# EAGLE design Lora_Basic_Gateway_ Module_V1.0_20230419 (EAGLE 9.5.1)
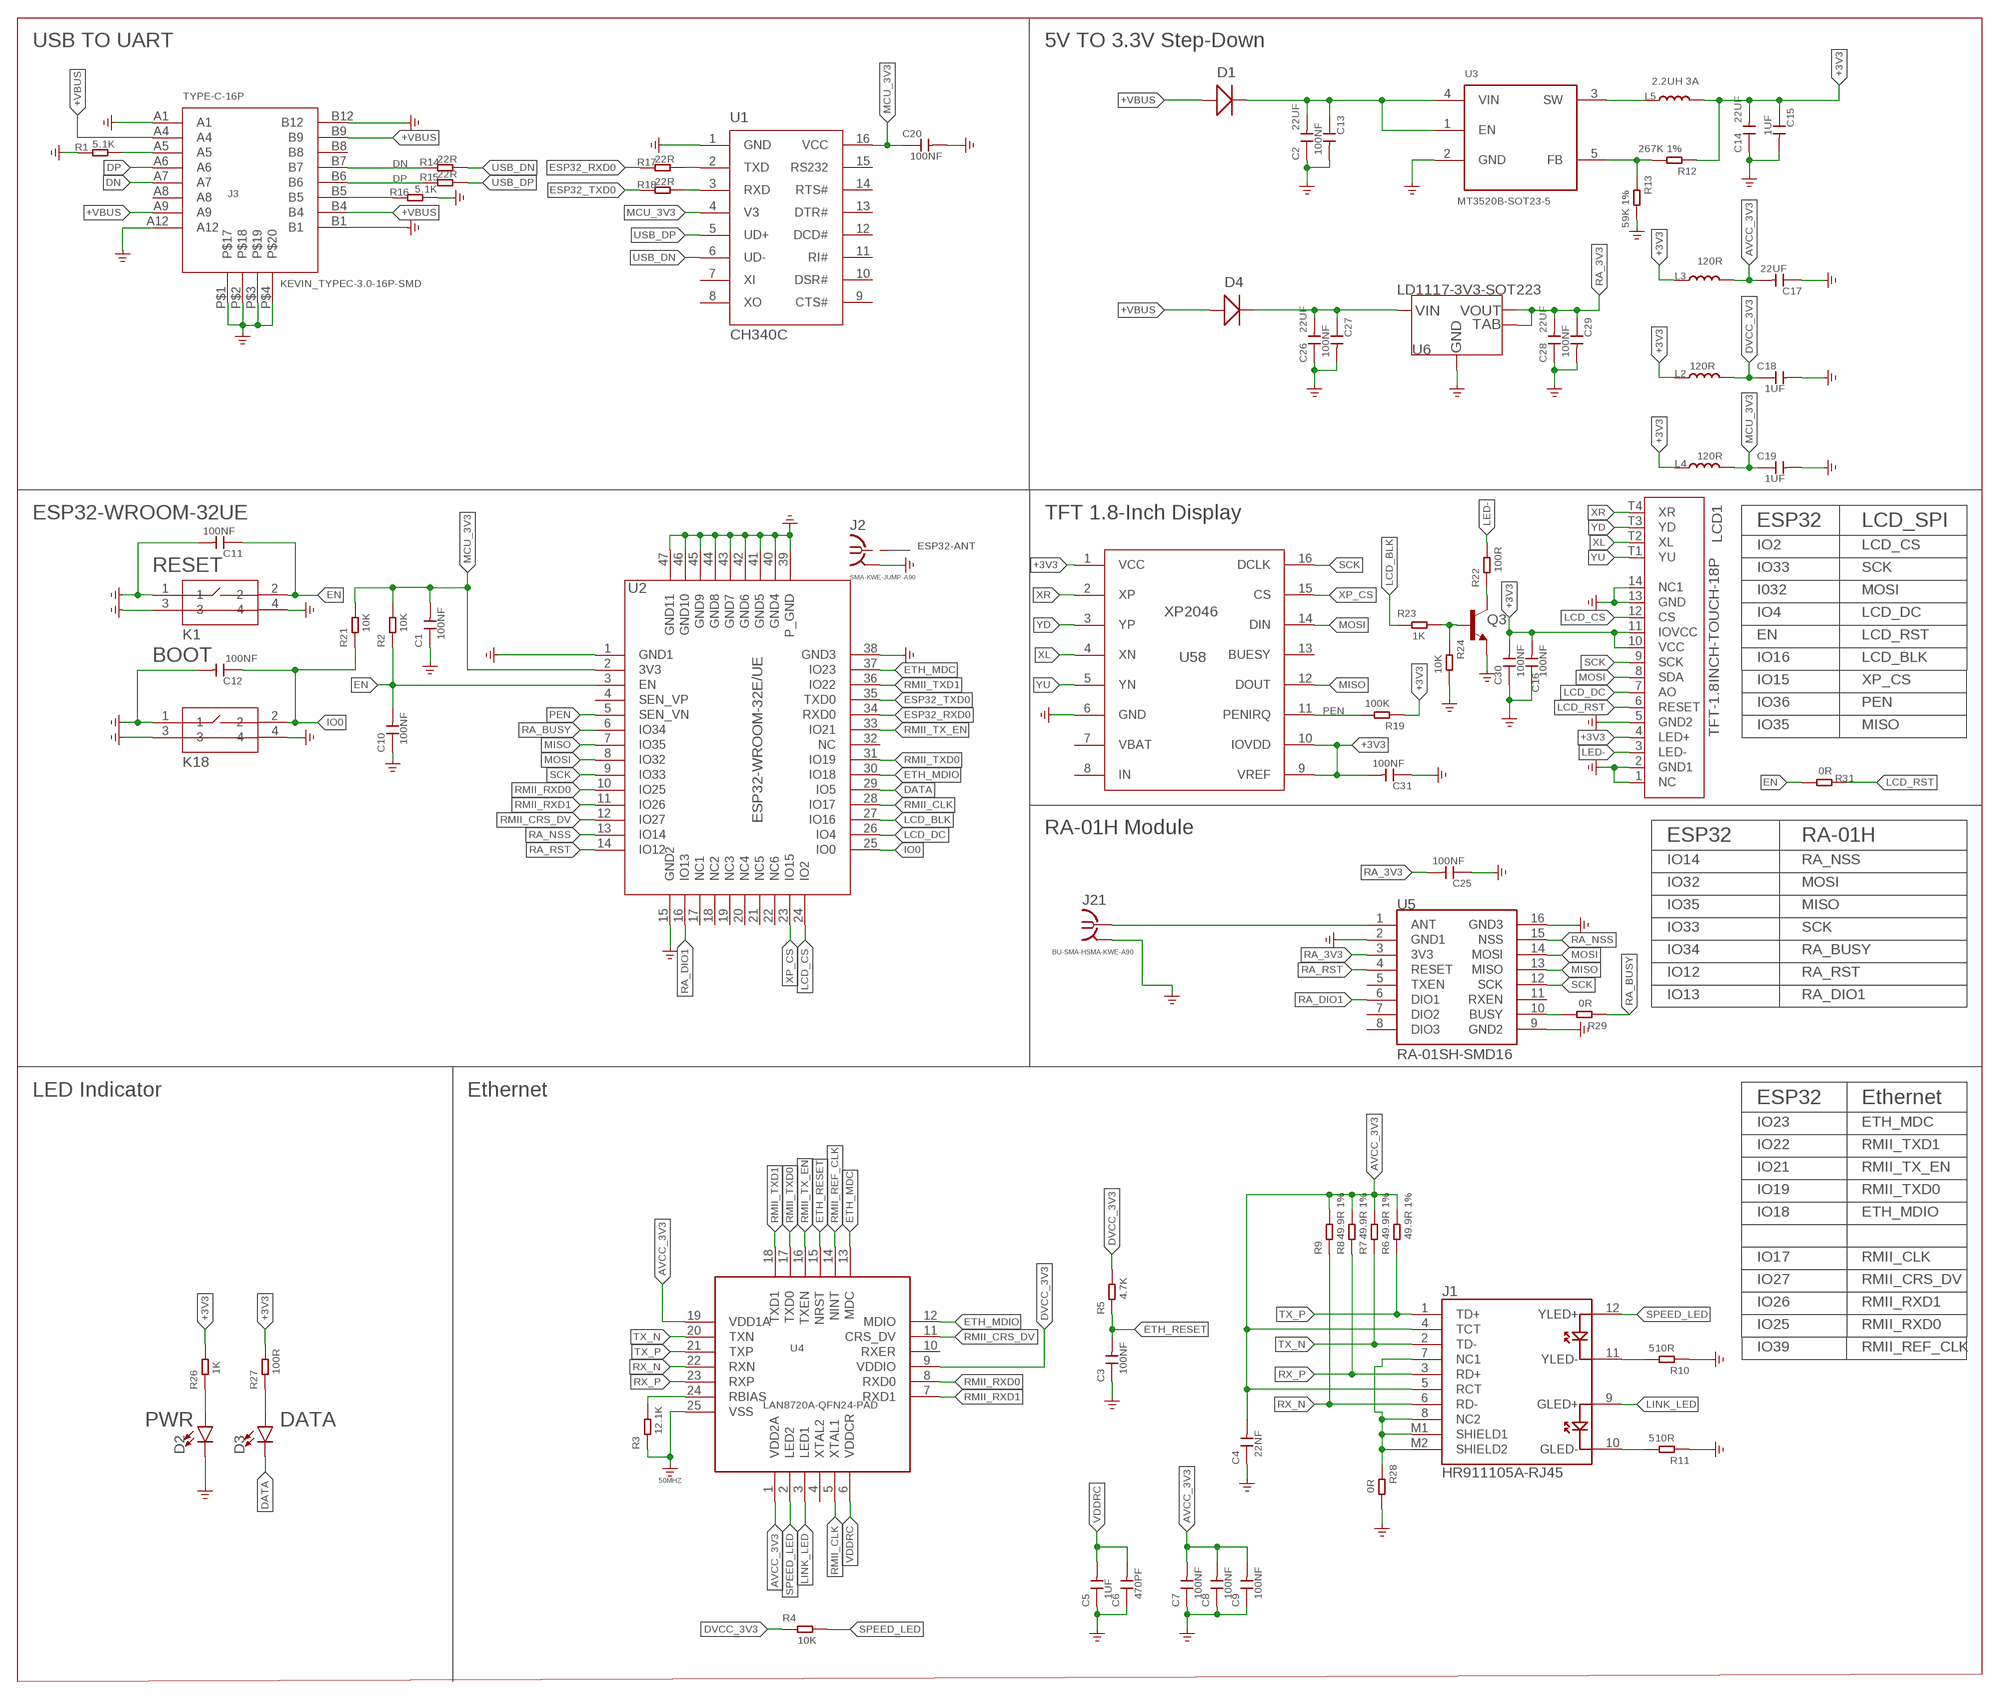
[diagram p0: schematic, sheet 1]

## Parts
C1  100NF  C0603  [C0603]
C2  22UF  C0805  [C0805]
C3  100NF  C0603  [C0603]
C4  22NF  C0603  [C0603]
C5  1UF  C0603  [C0603]
C6  470PF  C0603  [C0603]
C7  100NF  C0603  [C0603]
C8  100NF  C0603  [C0603]
C9  100NF  C0603  [C0603]
C10  100NF  C0603  [C0603]
C11  100NF  C0603  [C0603]
C12  100NF  C0603  [C0603]
C13  100NF  C0603  [C0603]
C14  22UF  C0805  [C0805]
C15  1UF  C0603  [C0603]
C16  100NF  C0603  [C0603]
C17  22UF  C0805  [C0805]
C18  1UF  C0603  [C0603]
C19  1UF  C0603  [C0603]
C20  100NF  C0603  [C0603]
C25  100NF  C0603  [C0603]
C26  22UF  C0805  [C0805]
C27  100NF  C0603  [C0603]
C28  22UF  C0805  [C0805]
C29  100NF  C0603  [C0603]
C30  100NF  C0603  [C0603]
C31  100NF  C0603  [C0603]
D1  DIODEB130L-13-F  [SMA]
D2  LED  [LED-F3MM-DIP2-A90]
D3  LED  [LED-F3MM-DIP2-A90]
D4  DIODEB130L-13-F  [SMA]
J1  HR911105A-RJ45  [HR911105A-RJ45]
J2  SMA-KWE-JUMP-A90  [SMA-KWE-JUMP-A90]
J3  KEVIN_TYPEC-3.0-16P-SMD  [KEVIN_3.0TYPEC-SMD]
J21  BU-SMA-HSMA-KWE-A90  [SMA-KWE-A90]
K1  KEY_666MM_DIPA90  [KEY_6*6*6MM_DIPA90]
K18  KEY_666MM_DIPA90  [KEY_6*6*6MM_DIPA90]
L2  120R  L0805  [L0805]
L3  120R  L0603  [L0603]
L4  120R  L0805  [L0805]
L5  2.2UH 3A  L  [L0420]
LCD1  TFT-1.8INCH-TOUCH-18P  [TFT-1.8INCH-TOUCH-18P-SMD]
Q3  600mA/40V  TRANS_NPN-MMBT2222AL  [SOT23-3]
R1  5.1K  R0603  [R0603]
R2  10K  R0603  [R0603]
R3  12.1K  R0603  [R0603]
R4  10K  R0603  [R0603]
R5  4.7K  R0603  [R0603]
R6  49.9R 1%  R0603  [R0603]
R7  49.9R 1%  R0603  [R0603]
R8  49.9R 1%  R0603  [R0603]
R9  49.9R 1%  R0603  [R0603]
R10  510R  R0603  [R0603]
R11  510R  R0603  [R0603]
R12  267K 1%  R0603  [R0603]
R13  59K 1%  R0603  [R0603]
R14  22R  R0603  [R0603]
R15  22R  R0603  [R0603]
R16  5.1K  R0603  [R0603]
R17  22R  R0603  [R0603]
R18  22R  R0603  [R0603]
R19  100K  R0603  [R0603]
R21  10K  R0603  [R0603]
R22  100R  R0603  [R0603]
R23  1K  R0603  [R0603]
R24  10K  R0603  [R0603]
R26  1K  R0603  [R0603]
R27  100R  R0603  [R0603]
R28  0R  R0603  [R0603]
R29  0R  R0603  [R0603]
R31  0R  R0603  [R0603]
U1  CH340C  CH340G  [SOP-16]
U2  ESP32-WROOM-32E/UE  [ESP32-WROOM-32UE]
U3  MT3520B-SOT23-5  HM3420B  [IC_SOT23-5]
U4  LAN8720A-QFN24-PAD  [QFN24-PAD]
U5  RA-01SH-SMD16  [RA-01SH-SMD16]
U6  LD1117-3V3-SOT223  [SOT223]
U58  XP2046  [XP2046-SSOP16]

## Nets
+3V3 [PWR]: C14.2 C15.1 C16.2 C30.2 C31.2 L2.1 L3.1 L4.1 L5.2 LCD1.4(LED+) LCD1.10(VCC) LCD1.11(IOVCC) R12.1 R19.1 R26.2 R27.2 U58.1(VCC) U58.9(VREF) U58.10(IOVDD)
+VBUS [PWR]: D1.2(+) D4.2(+) J3.A4 J3.A9 J3.B4 J3.B9
AVCC_3V3 [PWR]: C4.2 C7.2 C8.2 C9.2 C17.2 J1.4(TCT) J1.5(RCT) L3.2 R6.2 R7.2 R8.2 R9.2 U4.1(VDD2A) U4.19(VDD1A)
DATA: D3.K(C) U2.29(IO5)
DN: J3.A7 J3.B7 R14.1
DP: J3.A6 J3.B6 R15.1
DVCC_3V3 [PWR]: C18.1 L2.2 R4.1 R5.2 U4.9(VDDIO)
EN [PWR]: C10.2 C11.1 K1.2 R2.1 R31.2 U2.3(EN)
ESP32_RXD0: R17.1 U2.34(RXD0)
ESP32_TXD0: R18.1 U2.35(TXD0)
ETH_MDC: U2.37(IO23) U4.13(MDC)
ETH_MDIO: U2.30(IO18) U4.12(MDIO)
ETH_RESET: C3.2 R5.1 U4.15(NRST)
GND [PWR]: C1.1 C2.1 C3.1 C4.1 C5.1 C6.1 C7.1 C8.1 C9.1 C10.1 C11.2 C12.2 C13.2 C14.1 C15.2 C16.1 C17.1 C18.2 C19.2 C20.2 C25.1 C26.1 C27.2 C28.1 C29.2 C30.1 C31.1 D2.K(C) J2.2 J2.3 J2.4 J2.5 J3.A1 J3.A12 J3.B1 J3.B12 J3.P$1 J3.P$2 J3.P$3 J3.P$4 J21.2 J21.3 J21.4 J21.5 K1.1 K1.3 K1.4 K18.1 K18.3 K18.4 LCD1.1(NC) LCD1.2(GND1) LCD1.5(GND2) LCD1.13(GND) LCD1.14(NC1) Q3.2(E) R1.1 R3.1 R10.1 R11.1 R13.2 R16.2 R24.2 R28.2 U1.1(GND) U2.1(GND1) U2.15(GND2) U2.38(GND3) U2.39(P_GND) U2.40(GND4) U2.41(GND5) U2.42(GND6) U2.43(GND7) U2.44(GND8) U2.45(GND9) U2.46(GND10) U2.47(GND11) U3.2(GND) U4.25(VSS) U5.2(GND1) U5.9(GND2) U5.16(GND3) U6.1(GND) U58.6(GND) ; supply symbol labelled 50MHZ
IO0: C12.1 K18.2 R21.1 U2.25(IO0)
LCD_BLK: R23.1 U2.27(IO16)
LCD_CS: LCD1.12(CS) U2.24(IO2)
LCD_DC: LCD1.7(AO) U2.26(IO4)
LCD_RST: LCD1.6(RESET) R31.1
LED-: LCD1.3(LED-) R22.2
LINK_LED: J1.9(GLED+) U4.3(LED1)
MCU_3V3: C1.2 C19.1 C20.1 L4.2 R2.2 R21.2 U1.4(V3) U1.16(VCC) U2.2(3V3)
MISO: U2.7(IO35) U5.13(MISO) U58.12(DOUT)
MOSI: LCD1.8(SDA) U2.8(IO32) U5.14(MOSI) U58.14(DIN)
N$1: Q3.3(C) R22.1
N$2: D2.A R26.1
N$3: D3.A R27.1
N$4: C26.2 C27.1 D4.1(-) U6.3(VIN)
N$5: R29.2 U5.10(BUSY)
N$6: J1.7(NC1) J1.8(NC2) J1.M1(SHIELD1) J1.M2(SHIELD2) R28.1
N$9: Q3.1(B) R23.2 R24.1
N$10: J1.10(GLED-) R11.2
N$11 [ANT]: J21.1 U5.1(ANT)
N$15: J1.11(YLED-) R10.2
N$16: C2.2 C13.1 D1.1(-) U3.1(EN) U3.4(VIN)
N$17: R12.2 R13.1 U3.5(FB)
N$18: R3.2 U4.24(RBIAS)
N$19: L5.1 U3.3(SW)
N$20: J3.B5 R16.1
N$21: J3.A5 R1.2
N$22: R17.2 U1.2(TXD)
N$23: R18.2 U1.3(RXD)
PEN: R19.2 U2.5(SEN_VN) U58.11(PENIRQ)
RA_3V3 [PWR]: C25.2 C28.2 C29.1 U5.3(3V3) U6.2(VOUT) U6.4(TAB)
RA_BUSY: R29.1 U2.6(IO34)
RA_DIO1: U2.16(IO13) U5.6(DIO1)
RA_NSS: U2.13(IO14) U5.15(NSS)
RA_RST: U2.14(IO12) U5.4(RESET)
RMII_CLK: U2.28(IO17) U4.5(XTAL1)
RMII_CRS_DV: U2.12(IO27) U4.11(CRS_DV)
RMII_REF_CLK: U4.14(NINT)
RMII_RXD0: U2.10(IO25) U4.8(RXD0)
RMII_RXD1: U2.11(IO26) U4.7(RXD1)
RMII_TX_EN: U2.33(IO21) U4.16(TXEN)
RMII_TXD0: U2.31(IO19) U4.17(TXD0)
RMII_TXD1: U2.36(IO22) U4.18(TXD1)
RX_N: J1.6(RD-) R9.1 U4.22(RXN)
RX_P: J1.3(RD+) R8.1 U4.23(RXP)
SCK: LCD1.9(SCK) U2.9(IO33) U5.12(SCK) U58.16(DCLK)
SPEED_LED: J1.12(YLED+) R4.2 U4.2(LED2)
TX_N: J1.2(TD-) R7.1 U4.20(TXN)
TX_P: J1.1(TD+) R6.1 U4.21(TXP)
USB_DN: R14.2 U1.6(UD-)
USB_DP: R15.2 U1.5(UD+)
VDDRC: C5.2 C6.2 U4.6(VDDCR)
XL: LCD1.T2(XL) U58.4(XN)
XP_CS: U2.23(IO15) U58.15(CS)
XR: LCD1.T4(XR) U58.2(XP)
YD: LCD1.T3(YD) U58.3(YP)
YU: LCD1.T1(YU) U58.5(YN)
Unconnected: J3.A8 J3.B8 U1.7(XI) U1.8(XO) U1.9(CTS#) U1.10(DSR#) U1.11(RI#) U1.12(DCD#) U1.13(DTR#) U1.14(RTS#) U1.15(RS232) U2.4(SEN_VP) U2.17(NC1) U2.18(NC2) U2.19(NC3) U2.20(NC4) U2.21(NC5) U2.22(NC6) U2.32(NC) U4.4(XTAL2) U4.10(RXER) U5.5(TXEN) U5.7(DIO2) U5.8(DIO3) U5.11(RXEN) U58.7(VBAT) U58.8(IN) U58.13(BUESY)

## Notes on the sheet
- USB TO UART | 5V TO 3.3V Step-Down
- TYPE-C-16P
- ESP32-WROOM-32UE | TFT 1.8-Inch Display
- ESP32 | LCD_SPI
- ESP32-ANT | IO2 | LCD_CS
- RESET | IO33 | SCK
- I032 | MOSI
- IO4 | LCD_DC
- EN | LCD_RST
- BOOT | IO16 | LCD_BLK
- IO15 | XP_CS
- IO36 | PEN
- IO35 | MISO
- RA-01H Module
- ESP32 | RA-01H
- IO14 | RA_NSS
- IO32 | MOSI
- IO35 | MISO
- IO33 | SCK
- IO34 | RA_BUSY
- IO12 | RA_RST
- IO13 | RA_DIO1
- LED Indicator | Ethernet
- ESP32 | Ethernet
- IO23 | ETH_MDC
- IO22 | RMII_TXD1
- IO21 | RMII_TX_EN
- IO19 | RMII_TXD0
- IO18 | ETH_MDIO
- IO17 | RMII_CLK
- IO27 | RMII_CRS_DV
- IO26 | RMII_RXD1
- IO25 | RMII_RXD0
- IO39 | RMII_REF_CLK
- PWR | DATA

## Library data of the parts
C1 C3-C13 C15 C16 C18-C20 C25 C27 C29-C31 = Lora_Basic_Gateway_ Module:C0603
C2 C14 C17 C26 C28 = Lora_Basic_Gateway_ Module:C0805
D1 D4 = Lora_Basic_Gateway_ Module:DIODE*
D2 D3 = Lora_Basic_Gateway_ Module:LED: LED (Generic) Standard schematic elements and footprints for 5mm, 3mm, 1206, and 0603 sized LEDs. Generic LEDs with no color specified.
J1 = Lora_Basic_Gateway_ Module:HR911105A-RJ45
J2 = Lora_Basic_Gateway_ Module:SMA-KWE-JUMP-A90
J3 = Lora_Basic_Gateway_ Module:KEVIN_TYPEC-3.0-16P-SMD
J21 = Lora_Basic_Gateway_ Module:BU-SMA-H: FEMALE SMA CONNECTOR Radiall
K1 K18 = Lora_Basic_Gateway_ Module:KEY_6*6*6MM_DIPA90
L2-L5 = Lora_Basic_Gateway_ Module:L*
LCD1 = Lora_Basic_Gateway_ Module:TFT-1.8INCH-TOUCH-18P
Q3 = Lora_Basic_Gateway_ Module:TRANS_NPN: NPN transistor Current controlled devices typically used to amplify current or used as a switch. BC547 - COM-08928 <http://www.sparkfun.com/products/8928> (TO-92 45V 100mA) (1.Collector 2.Base 3.Emitter) 2N3904 - COM-00521 <http://www.sparkfun.com/products/521> (TO-92 40V 200mA) (1.Emitter 2.Base 3.Collector) P2N2222A - COM-12852 <http://www.sparkfun.com/products/12852> (TO-92 40V 600mA) (1.Collector 2.Base 3.Emitter); PROD_ID: TRANS-08049
R1-R19 R21-R24 R26-R29 R31 = Lora_Basic_Gateway_ Module:R0603
U1 = Lora_Basic_Gateway_ Module:CH340G
U2 = Lora_Basic_Gateway_ Module:ESP32-WROOM-32E/UE
U3 = Lora_Basic_Gateway_ Module:HM3420B
U4 = Lora_Basic_Gateway_ Module:LAN8720A-QFN24-PAD
U5 = Lora_Basic_Gateway_ Module:RA-01SH-SMD16
U6 = Lora_Basic_Gateway_ Module:LD1117-3V3-SOT223
U58 = Lora_Basic_Gateway_ Module:XP2046

## Net classes
0 default: width 0.203 mm, clearance 0.152 mm
1 PWR: width 0.305 mm
2 ANT: clearance 0.457 mm

## Board
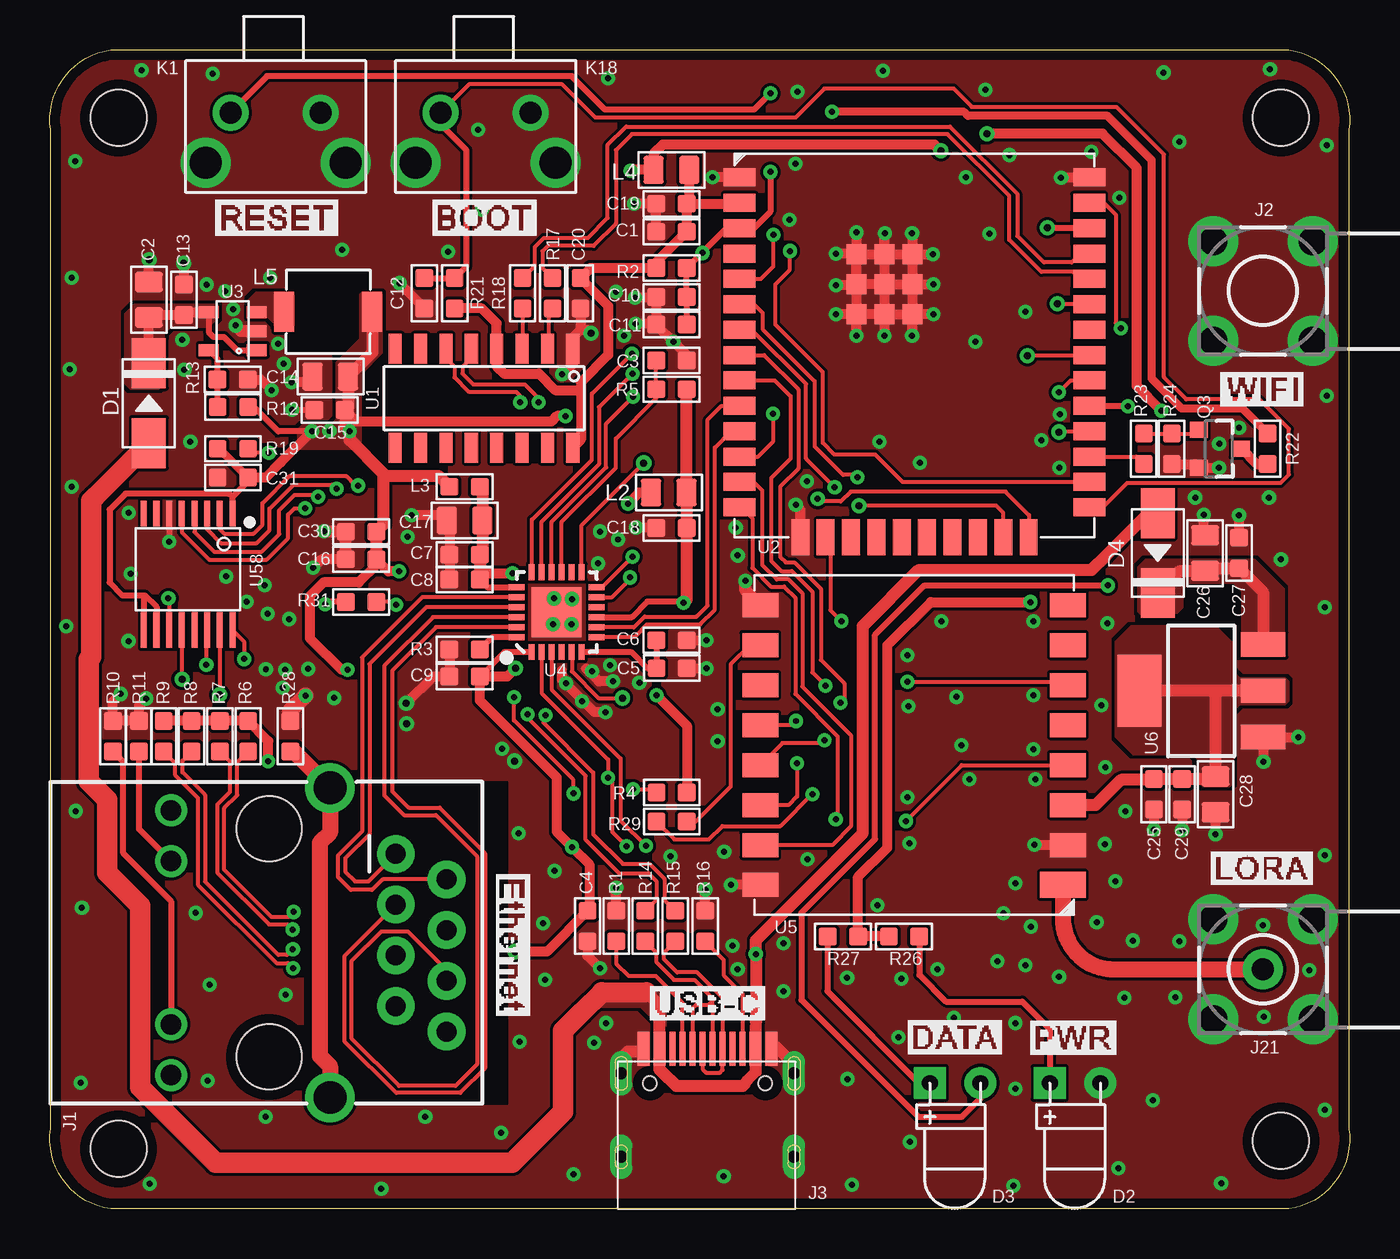
[diagram p1: board, top side]
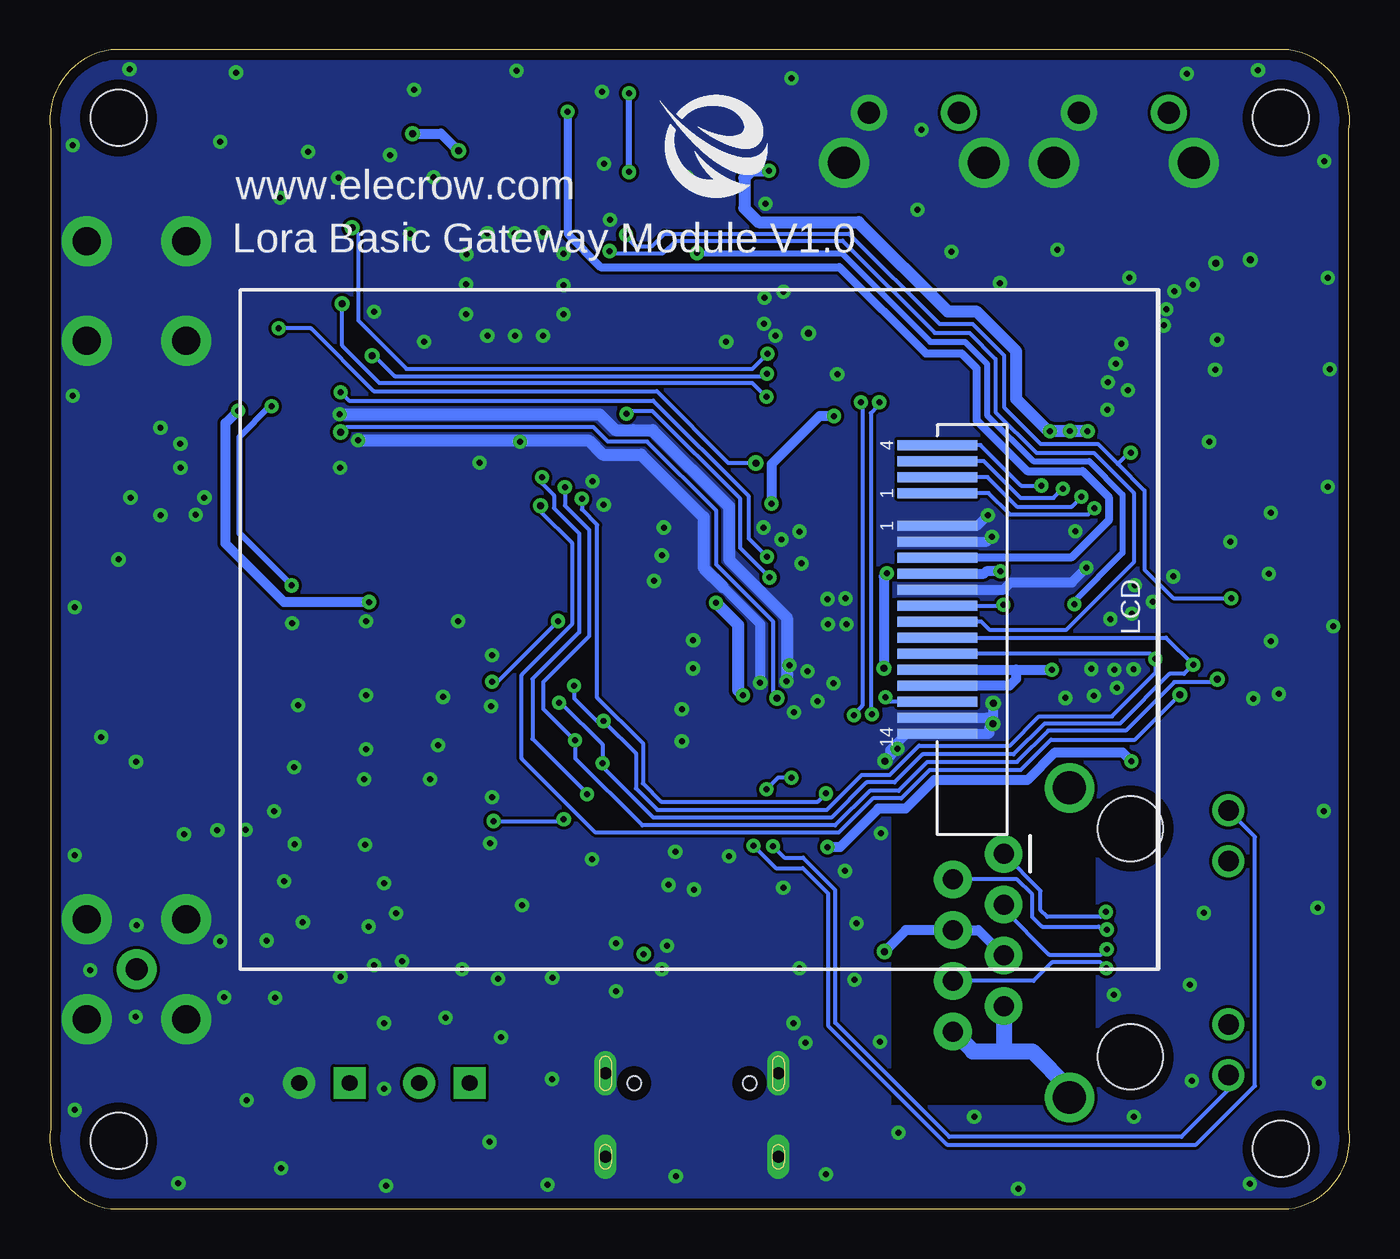
[diagram p2: board, bottom side, seen from below]

Size 65.06 x 58 mm. Coordinates in mm from the lower left corner, seen from the top.
Outline: 65.03,54 65.03,4 arc-90 62.03,0 3.03,0 arc-90 0.03,4 0.03,54 arc-90 3.03,58 62.03,58 arc-90 65.03,54
Copper layers (1*16): Top 0.035mm / dielectric 1.5mm / Bottom 0.035mm
Design rules "default *": minimum track width 8mil, minimum drill 0.3mm, track to track 6mil, track to pad 6mil, pad to pad 6mil, via to via 6mil, smd to smd 6mil, copper to edge 20mil, drill to drill 6mil, minimum pad ring 10mil, minimum via ring 8mil, stop-mask expansion 4mil, vias tented up to drill 100mil, thermal gap 10mil
Holes 2.8 mm at 3.43,54.6 61.63,54.6 61.63,3.4 3.43,3
tRestrict: area 12.7,5.2 to 22.9,21.4; 11 lines
bRestrict: area 12.7,5.2 to 22.9,21.4

### Footprints (pad centres in the part's own frame; a part is rotated, then mirrored left to right if it is on the bottom)
C0603 = smd 0.889 x 0.889: 1 -0.762,0; 2 0.762,0
C0805 = smd 1.016 x 1.397: 1 -0.889,0; 2 0.889,0
SMA = smd 2.5 x 1.7: 1 2,0; 2 -2,0
LED-F3MM-DIP2-A90 = drill 0.8 pad 1.6 square: A 1.27,0 | drill 0.8 pad 1.6: K -1.27,0
HR911105A-RJ45 = drill 1 pad 1.88: 1 4.445,-7.285; 2 3.175,-9.825; 3 1.905,-7.285; 4 0.635,-9.825; 5 -0.635,-7.285; 6 -1.905,-9.825; 7 -3.175,-7.285; 8 -4.445,-9.825 | drill 1.02 pad 1.6: 9 6.625,3.965; 10 4.085,3.965; 11 -4.085,3.965; 12 -6.625,3.965 | drill 1.65 pad 2.184: M1 7.745,-3.985; M2 -7.745,-3.985 | hole 3.25: 5.715,-0.935; -5.715,-0.935
SMA-KWE-JUMP-A90 = drill 1.4 pad 2.5: 2 -2.5,2.5; 3 2.5,2.5; 4 2.5,-2.5; 5 -2.5,-2.5
KEVIN_3.0TYPEC-SMD = smd 0.3 x 1.7: A1 -3.35,0.5; A4 -2.55,0.5; A5 -1.25,0.5; A6 -0.25,0.5; A7 0.25,0.5; A8 1.25,0.5; A9 2.55,0.5; A12 3.35,0.5; B1 3.05,0.5; B4 2.25,0.5; B5 1.75,0.5; B6 0.75,0.5; B7 -0.75,0.5; B8 -1.75,0.5; B9 -2.25,0.5; B12 -3.05,0.5 | drill 0.6 pad 1.016 long: P$1 -4.325,-0.72; P$2 4.325,-0.72; P$3 -4.325,-4.9; P$4 4.325,-4.9 | hole 0.68: -2.89,-1.22; 2.89,-1.22
SMA-KWE-A90 = drill 1.1 pad 2: 1 0,0 | drill 1.4 pad 2.5: 2 -2.5,2.5; 3 2.5,2.5; 4 2.5,-2.5; 5 -2.5,-2.5
KEY_6*6*6MM_DIPA90 = drill 1.1 pad 1.8: 1 -2.35,-1.2; 2 2.15,-1.2 | drill 1.6 pad 2.5: 3 -3.6,1.3; 4 3.4,1.3
L0805 = smd 1.016 x 1.397: 1 -0.889,0; 2 0.889,0
L0603 = smd 0.889 x 0.889: 1 -0.762,0; 2 0.762,0
L0420 = smd 2 x 1: 1 0,2.2; 2 0,-2.2
TFT-1.8INCH-TOUCH-18P-SMD = smd 0.5 x 4: 1 10.4,0; 2 9.6,0; 3 8.8,0; 4 8,0; 5 7.2,0; 6 6.4,0; 7 5.6,0; 8 4.8,0; 9 4,0; 10 3.2,0; 11 2.4,0; 12 1.6,0; 13 0.8,0; 14 0,0; T1 12.03,0; T2 12.83,0; T3 13.63,0; T4 14.43,0
SOT23-3 = smd 0.8 x 0.9: 1 -0.95,-1; 2 0.95,-1; 3 0,1.1
R0603 = smd 0.889 x 0.889: 1 -0.762,0; 2 0.762,0
SOP-16 = smd 0.66 x 1.5: 1 -4.445,-2.475; 2 -3.175,-2.475; 3 -1.905,-2.475; 4 -0.635,-2.475; 5 0.635,-2.475; 6 1.905,-2.475; 7 3.175,-2.475; 8 4.445,-2.475; 9 4.445,2.475; 10 3.175,2.475; 11 1.905,2.475; 12 0.635,2.475; 13 -0.635,2.475; 14 -1.905,2.475; 15 -3.175,2.475; 16 -4.445,2.475
ESP32-WROOM-32UE = smd 1.6 x 0.9: 1 0,18.01; 2 0,16.74; 3 0,15.47; 4 0,14.2; 5 0,12.93; 6 0,11.66; 7 0,10.39; 8 0,9.12; 9 0,7.85; 10 0,6.58; 11 0,5.31; 12 0,4.04; 13 0,2.77; 14 0,1.5; 25 17.5,1.5; 26 17.5,2.77; 27 17.5,4.04; 28 17.5,5.31; 29 17.5,6.58; 30 17.5,7.85; 31 17.5,9.12; 32 17.5,10.39; 33 17.5,11.66; 34 17.5,12.93; 35 17.5,14.2; 36 17.5,15.47; 37 17.5,16.74; 38 17.5,18.01 | smd 0.9 x 1.8: 15 3.035,0; 16 4.305,0; 17 5.575,0; 18 6.845,0; 19 8.115,0; 20 9.385,0; 21 10.655,0; 22 11.925,0; 23 13.195,0; 24 14.465,0 | smd 1 x 1: 39 8.65,11.16; 40 7.25,11.16; 41 5.85,11.16; 42 8.65,12.66; 43 7.25,12.66; 44 5.85,12.66; 45 8.65,14.16; 46 7.25,14.16; 47 5.85,14.16
IC_SOT23-5 = smd 0.6 x 1: 1 -0.95,-1.2; 2 0,-1.2; 3 0.95,-1.2; 4 0.95,1.2; 5 -0.95,1.2
QFN24-PAD = smd 0.8 x 0.3: 1 -2,1.25; 2 -2,0.75; 3 -2,0.25; 4 -2,-0.25; 5 -2,-0.75; 6 -2,-1.25; 13 2,-1.25; 14 2,-0.75; 15 2,-0.25; 16 2,0.25; 17 2,0.75; 18 2,1.25 | smd 0.3 x 0.8: 7 -1.25,-2; 8 -0.75,-2; 9 -0.25,-2; 10 0.25,-2; 11 0.75,-2; 12 1.25,-2; 19 1.25,2; 20 0.75,2; 21 0.25,2; 22 -0.25,2; 23 -0.75,2; 24 -1.25,2 | smd 2.5 x 2.5: 25 0,0
RA-01SH-SMD16 = smd 2.3 x 1.3: 1 -7.45,7 | smd 1.8 x 1.2: 2 -7.7,5; 3 -7.7,3; 4 -7.7,1; 5 -7.7,-1; 6 -7.7,-3; 7 -7.7,-5; 8 -7.7,-7; 9 7.7,-7; 10 7.7,-5; 11 7.7,-3; 12 7.7,-1; 13 7.7,1; 14 7.7,3; 15 7.7,5; 16 7.7,7
SOT223 = smd 1.219 x 2.235: 1 -2.311,-3.099; 2 0,-3.099; 3 2.311,-3.099 | smd 3.6 x 2.2: 4 0,3.099
XP2046-SSOP16 = smd 0.305 x 1.27: 1 -2.54,-2.54; 2 -1.905,-2.54; 3 -1.27,-2.54; 4 -0.635,-2.54; 5 0,-2.54; 6 0.635,-2.54; 7 1.27,-2.54; 8 1.905,-2.54 | smd 0.305 x 1.778: 9 1.905,3.302; 10 1.27,3.302; 11 0.635,3.302; 12 0,3.302; 13 -0.635,3.302; 14 -1.27,3.302; 15 -1.905,3.302; 16 -2.54,3.302

### Placement (x,y rotation side)
C1  31.11,48.9 0 top
C2  4.95,45.5 270 top
C3  31.11,42.46 180 top
C4  26.91,14.15 90 top
C5  31.13,27.06 180 top
C6  31.11,28.46 180 top
C7  20.76,32.74 0 top
C8  20.76,31.5 0 top
C9  20.76,26.64 0 top
C10  31.11,45.64 0 top
C11  31.11,44.26 180 top
C12  18.75,45.83 270 top
C13  6.71,45.5 90 top
C14  14.04,41.65 0 top
C15  14.01,39.98 180 top
C16  15.57,32.51 0 top
C17  20.76,34.45 0 top
C18  31.11,34.08 180 top
C19  31.11,50.3 180 top
C20  26.56,45.83 270 top
C25  55.26,20.74 90 top
C26  57.83,32.82 270 top
C27  59.53,32.82 90 top
C28  58.35,20.74 90 top
C29  56.68,20.74 270 top
C30  15.57,33.89 0 top
C31  9.16,36.6 0 top
D1  4.95,40.32 90 top
D2  51.32,6.3 180 top
D3  45.32,6.3 180 top
D4  55.46,32.82 270 top
J1  10.03,13.32 90 top
J2  60.73,45.94 0 top
J3  32.93,7.51 0 top
J21  60.73,11.99 0 top
K1  KEY_66*6MM_DIPA90  [KEY_6*6*6MM_DIPA90]  11.2,53.66 180 top
K18  KEY_66*6MM_DIPA90  [KEY_6*6*6MM_DIPA90]  21.71,53.66 180 top
L2  30.98,35.85 0 top
L3  20.76,36.14 0 top
L4  31.11,52 0 top
L5  13.93,44.9 90 top
LCD1  20.64,23.79 90 bottom
Q3  58.51,38.04 270 top
R1  28.35,14.15 270 top
R2  31.11,47.08 180 top
R3  20.76,28 0 top
R4  31.13,20.83 180 top
R5  31.11,41.02 0 top
R6  9.92,23.66 90 top
R7  8.51,23.66 90 top
R8  7.09,23.66 90 top
R9  5.69,23.66 90 top
R10  3.15,23.66 270 top
R11  4.46,23.66 270 top
R12  9.16,40.13 180 top
R13  9.15,41.5 0 top
R14  29.8,14.15 90 top
R15  31.3,14.15 90 top
R16  32.8,14.15 90 top
R17  25.16,45.83 270 top
R18  23.66,45.83 270 top
R19  9.16,38.04 0 top
R21  20.26,45.83 270 top
R22  60.96,38.04 90 top
R23  54.76,38.04 90 top
R24  56.16,38.04 270 top
R26  42.76,13.63 180 top
R27  39.7,13.63 0 top
R28  12.03,23.66 90 top
R29  31.13,19.38 0 top
R31  15.58,30.38 180 top
U1  21.73,40.57 180 top
U2  34.53,33.61 0 top
U3  9.15,43.93 90 top
U4  25.37,29.87 90 top
U5  43.26,23.21 180 top
U6  57.64,25.93 90 top
U58  6.6,32.27 180 top
U$160  [ELECROW-NEW]  34.56,50.6 0 bottom

### Tracks (layer width: path | path; a pad name or v marks a point on that pad's centre or on a via)
+3V3  (via drill 0.3, 0.3 pad 0.6, 0.35)
  Top 0.305: 14.84,39.91 C15.1 | v13.12,38.91 11.43,38.91 10.22,40.13 R12.1 | C31.2 9.92,36.42 9.14,35.64 | U58.1 9.14,35.64 | 8.48,38.04 R19.1 | 9.14,35.64 8.98,35.8 3.78,35.8 2.98,35 2.98,31.35 3.62,30.71 4.7,30.71 | 4.7,30.71 4.75,30.71 5.33,30.13 U58.10 | 4.7,30.71 U58.9
  Top 0.406: C31.2 8.48,38.04
  Top 0.5: v25.82,39.68 25.81,39.69 25.4,39.69 25.11,39.4 15.35,39.4 14.84,39.91 | v46.92,53.81 52.69,53.81 54.41,52.1 54.41,41.19 v55.64,39.95 | v44.6,52.96 44.29,53.27 30.67,53.27 30.22,52.82 L4.1 | R27.2 40.46,16.62 41.92,18.07 41.92,28.2 44.1,30.37 v49.09,30.37 | v17.47,31.91 16.93,31.91 C16.2 16.33,32.22 15.46,31.35 13.7,31.35 13.01,30.66 13.01,28.57 14.59,26.99 v14.9,26.99 | v13.12,38.91 11.56,37.36
  Top 0.508: L2.1 29.48,35.85 v28.93,35.3 | L4.1 29.12,52 v29.07,51.95 | R26.2 R27.2 | 11.56,37.36 10.8,36.6 C31.2
  Top 0.6: L3.1 19.45,36.69 16.69,36.69 | 16.69,36.69 16.69,34.25 C30.2 C16.2 | C15.1 14.77,39.15 v15,38.92 15,38.49 16.69,36.8 16.69,36.69
  Top 0.61: L5.2 16.13,42.85 C14.2 14.93,40.14 C15.1
  Bottom 0.5: v25.82,39.68 26.53,39.68 28.93,37.28 28.93,36.09 | 28.93,36.09 v28.93,35.3 | v46.92,53.81 45.49,53.81 44.64,52.96 v44.6,52.96 | v49.09,30.37 53.35,30.37 56.27,33.3 56.27,39.33 v55.64,39.95 | 16.69,26.99 v14.9,26.99 | 16.69,26.99 16.69,26.52 17.02,26.19 LCD1.11 | v17.47,31.91 18.18,31.91 18.3,31.79 LCD1.4 | LCD1.10 16.69,26.99 | 28.93,36.09
  Bottom 0.6: v29.07,51.95 29.94,51.95 30.3,51.59 30.3,50.09 29.6,49.38 24.58,49.38 20.11,44.91 18.69,44.91 16.68,42.91 16.68,40.52 15.08,38.92 v15,38.92 v14.99,38.93 v13.99,38.93 13.98,38.91 v13.12,38.91
  pour Top (no thermals): 15.51,45.56 15.51,45.78 15.62,45.89 16.53,45.89 16.63,45.79 16.63,42.81 15.57,41.75 15.57,38.37 15.18,37.98 13.1,37.98 12.56,37.98 12.41,38.13 12.41,39.01 12.4,39.02 12.68,39.3 13.14,39.3 14.11,39.3 14.26,39.45 14.33,39.52 14.33,40.29 14.33,42.36 14.68,42.71 15.51,43.54
+VBUS  (via drill 0.3 pad 0.6)
  Top 0.305: 35.34,10.62 35.48,10.77 | 30.47,10.24 30.53,10.3 | 30.68,7.83 J3.B9 | 30.47,10.24 30.38,10.16 J3.A4 30.38,6.92 30.68,6.62 30.68,6.83 J3.B9 | J3.B9 30.68,10.03 30.47,10.24 | 35.35,9.37 35.35,9.32 | 35.35,9.32 35.46,9.43 35.46,8.02 J3.A9 35.48,6.8 34.7,6.02 34.7,6.36 34.79,6.26 34.79,6.49 35.18,6.87 J3.B4 35.18,9.15 35.35,9.32
  Top 0.6: 29.86,10.85 30.47,10.24 | 35.34,10.62 v35.34,12.75 35.34,13.44 40.7,18.8 40.7,29.16 43.51,31.97 50.86,31.97 | D4.2 55,34.82 52.91,32.74
  Top 0.61: 35.34,10.62 35.34,9.39 35.35,9.37 | 50.86,31.97 52.15,31.97 52.91,32.74 | 34.79,6.26 34.68,6.15 31.35,6.15 30.68,6.83
  Top 1: 26.6,9.82 27.63,10.85 29.86,10.85 | 2.25,35.62 D1.2
  Top 1.016: 26.6,9.82 25.7,8.92 25.7,4.86 23.14,2.3 8.3,2.3 4.52,6.08 4.52,15.16 2.86,16.82 2.86,20.47 1.93,21.4 1.93,27.5 2.07,27.63 2.07,35.43 2.25,35.62
  Bottom 0.5: 35.4,12.81 v35.34,12.75
  pour Top: 27.63,11.3 30.03,11.3 30.83,10.5 30.83,8.77 30.72,8.66 30.34,8.66 30.23,8.77 30.23,9.41 29.58,10.06 27.53,10.06 27.53,11.2
  pour Top (no thermals): 30.23,8.53 30.23,7.96 30.41,7.78 30.64,7.78 30.82,7.96 30.82,8.42 30.82,8.56 30.23,8.56 30.23,8.54
AVCC_3V3  (via drill 0.3 pad 0.6, 0.35)
  Top 0.305: C9.2 22.75,27.87 U4.1 | C8.2 21.91,31.11 U4.19
  Top 0.5: 21.82,31.8 C8.2 21.83,31.81 v23.15,31.81
  Top 0.508: v23.3,27.05 22.89,26.64 C9.2 21.52,25.44 25.37,21.59 25.37,18.88 v26.14,18.11 27.01,17.24 27.01,15.02 C4.2 24.88,12.88 v23.29,12.88 | v10.93,22.41 10.93,23.41 R6.2 R7.2 R8.2 R9.2
  Top 0.6: L3.2 21.65,36.01 C17.2 21.65,32.87 C7.2 C8.2
  Bottom 0.5: v23.3,27.05 v23.31,27.06 23.31,31.65 v23.15,31.81
  Bottom 0.508: v10.93,22.41 11.37,22.85 14.75,22.85 16.14,21.46 20.8,21.46 22.23,20.04 23.59,20.04 25.51,18.11 v26.14,18.11 | v23.29,12.88 22.22,13.96 J1.4 18.59,13.96 J1.5
DATA  (via drill 0.3 pad 0.6)
  Top 0.305: v52.96,31.2 43.78,31.2 41.31,28.73 41.31,18.51 37.62,14.82 37.62,10.46 43.48,4.6 45.65,4.6 46.59,5.54 D3.K | U2.29 53.93,40.19 v53.96,40.16
  Bottom 0.305: v52.96,31.2 55.57,33.81 55.57,38.64 54.05,40.16 v53.96,40.16
DN
  Top 0.203: 33.18,10.2 33.18,10.04 | 33.18,10.2 33.18,10.43 | 33.18,10.43 33.18,10.55 32.27,11.47 31.24,11.47 30.38,12.33 30.38,12.82 R14.1 | 32.95,10.2 32.33,10.2 32.18,10.04 J3.B7 | 33.02,10.2 33.18,10.2 | 33.18,10.43 32.95,10.2 | 32.95,10.2 33.02,10.2 | 33.02,10.2 33.18,10.04 | 33.18,10.04 J3.A7
DP
  Top 0.203: R15.1 30.73,12.82 30.73,12.51 31.4,11.84 32.4,11.84 33.54,10.7 33.54,10.69 33.68,10.55 J3.B6 | J3.B6 | J3.A6 32.68,7 32.85,6.82 33.54,6.82 33.68,6.96 J3.B6
DVCC_3V3  (via drill 0.3 pad 0.6)
  Top 0.305: U4.9 29.13,29.62 29.92,30.4 31.78,30.4
  Top 0.508: v30.37,25.71 31.89,24.19 R4.1
  Top 0.61: R5.2 L2.2 C18.1 31.87,30.49 31.78,30.4 v31.72,30.34
  Bottom 0.61: v31.72,30.34 30.61,29.23 30.61,25.95 v30.37,25.71
EN  (via drill 0.3 pad 0.6)
  Top 0.305: 32.65,47.85 R2.1 C10.2 C11.1 | 32.65,47.85 33.88,49.08 U2.3 35.24,49.08 36.07,49.91 v36.07,51.9 | 35.99,55.76 v36.07,55.84 35.25,55.02 27.79,55.02 26.12,56.69 10.87,56.69 K1.2 | v32.66,47.84 32.65,47.85 | R31.2 13.9,30.38 v13.78,30.26
  Bottom 0.305: v36.07,55.84 36.09,55.82 36.09,51.91 v36.07,51.9 | v32.66,47.84 32.65,47.82 25.42,47.82 20.99,43.39 19.25,43.39 18.15,42.3 18.15,39.73 15.84,37.42 13.04,37.42 11.36,35.75 11.36,32.83 13.78,30.41 v13.78,30.26
ESP32_RXD0
  Top 0.203: U2.34 51.57,46.54 51.22,46.89 49.64,46.89 48.03,48.5 48.03,50.7 44.94,53.79 29.14,53.79 28.33,52.98 28.33,49.31 27.23,48.2 24.93,48.2 24.66,47.93 24.66,47.09 R17.1
ESP32_TXD0
  Top 0.203: R18.1 24.26,47.19 24.26,48.13 24.73,48.6 26.93,48.6 27.92,49.59 27.92,53.25 28.84,54.17 45.07,54.17 48.43,50.8 48.43,48.7 49.77,47.37 51.16,47.37 51.6,47.81 U2.35
ETH_MDC  (via drill 0.3 pad 0.6, 0.35 pad 0.6)
  Top 0.203: U4.13 26.62,34.22 v29.73,37.33 | v53.61,44.07 53.35,44.33 53.35,49.76 52.76,50.35 U2.37
  Bottom 0.203: v29.73,37.33 31.08,37.33 34.68,40.92 48.85,40.92 52,44.07 v53.61,44.07
ETH_MDIO  (via drill 0.3 pad 0.6)
  Top 0.203: U4.12 27.65,31.12 v29.17,32.64 | v50.51,40.87 51.1,41.46 U2.30
  Bottom 0.203: v29.17,32.64 30.07,33.54 30.07,35.66 34.87,40.45 50.09,40.45 v50.51,40.87
ETH_RESET
  Top 0.203: U4.15 25.62,34.38 28.33,37.09 28.33,38.55 30.35,40.56 R5.1 C3.2
GND  (via drill 0.3, 0.3 pad 0.6, 0.35)
  Top 0.305: C6.1 | 32.85,27.06 v32.87,27.05 | C15.2 v12.13,39.98 v12.12,39.99 | U5.9 | U58.6 v5.97,33.4 v5.96,33.39 | J3.A1 28.86,8.01 28.53,7.68 28.53,7.29 | 28.53,7.29 28.53,6.86 J3.P$1 | J3.B12 29.59,7.72 28.97,7.72 28.53,7.29 | J3.A12 37.25,7.03 J3.P$2 37.25,7.41 36.41,8.25 36.22,8.25 J3.B1
  Top 0.5: C6.1 v32.86,28.45 | C5.1 32.85,27.06 | v28.18,26.4 27.49,26.4 26.85,27.04 26.85,27.05 | v27.83,24.86 27.25,24.86 25.63,26.49 25.63,26.95 | C20.2 26.56,43.99 | 26.56,43.99 26.16,43.59 26.16,43.06 U1.1 | v58.53,37.09 Q3.2 57.32,37.28 R24.2 | 26.56,43.99 26.93,43.99 v27.1,43.82 | C13.2 6.71,47.31 v6.7,47.33 | C2.1 v4.95,47.48 v4.96,47.49 | R16.2 32.8,15.97 v32.82,15.98 | U5.16 v34.09,16.21 | U5.2 v49.29,18.21 v49.29,18.22 | C25.1 v55.26,18.98 | C29.2 v56.68,18.95 | C28.1 v58.35,18.76 v58.36,18.75 | v60.76,22.37 60.74,22.39 U6.1 v62.49,23.62 v62.49,23.61 | C26.1 57.78,33.77 v57.78,34.74 | C27.2 v59.53,34.71 | U2.38 52.02,51.6 v50.62,51.6 | U2.46 41.78,48.81 v41.8,48.83 | U2.45 43.18,48.82 v43.17,48.83 | U2.45 43.19,47.77 | 43.19,47.77 v44.21,47.77 | U2.42 v44.23,46.27 | v44.23,46.27 | U2.39 v44.22,44.77 | U2.39 43.17,44.76 v43.17,43.71 | U2.40 v41.78,43.7 | v41.78,43.7 | U2.41 40.38,43.71 v40.37,43.7 | U2.41 v39.35,44.77 | U2.44 40.33,46.22 v39.35,46.22 | U2.47 40.35,47.8 v39.36,47.8 | U2.47 U2.46 | U2.47 U2.45 | U2.46 U2.43 | U2.43 U2.44 | U2.43 U2.42 | U2.40 U2.41 | U2.40 U2.39 | U2.42 U2.39 | U2.42 43.19,46.28 43.19,47.77 | U2.43 U2.40 | U2.44 U2.41 | U2.44 U2.47 | C1.1 C19.2 | C10.1 C11.2 | C11.2 v31.21,43.4 31.87,42.74 C3.1 | C11.2 30.32,44.29 v29.31,44.29 | v18.1,34.72 19.6,34.72 C17.1 20,34.32 C7.1 C8.1 | R3.1 C9.1 | C16.1 13.61,32.51 13.19,32.09 v13.17,32.09
  Top 0.508: C18.2 29.35,34.08 v29.33,34.1 | C12.2 18.75,45.08 v17.5,46.34 | U1.1 26.18,42.3 v25.65,41.77 | C10.1 30.31,45.6 v29.3,45.6 | C19.2 29.26,50.3 v29.25,50.31 | U2.1 33.19,51.62 v33.18,51.64 | U2.47 v40.38,48.86 v40.37,48.87 | U2.15 37.57,35.01 v37.34,35.24 | C14.1 12.87,41.36 v12.1,41.36 | C4.1 26.91,12.66 v27.53,12.04 | C9.1 19.17,26.64 v17.84,25.31 | R13.2 10.56,41.5 v11.09,40.97 | R1.1 v28.35,16.07 | v4.82,25.54 4.46,25.18 R11.1 R10.1 3.15,25.37 v3.55,25.77
  Top 0.6: U3.2 9.57,43.93 v9.29,44.21 | U5.9 34.83,30.95 v34.83,31.43 | v13.73,33.92 13.76,33.89 C30.1 C16.1
  Top 0.813: R28.2 12.03,24.93 v12.79,25.69
  Bottom 0.5: 31.37,31.13 31.32,31.08 29.51,29.27 29.51,26.32 29.54,26.29 | v17.91,33.63 18.15,33.39 LCD1.2 | v13.17,32.09 13.9,31.36 16.95,31.36 17.32,30.99 LCD1.5 | v23.26,22.41 23.01,22.66 23.01,22.96 | 22.29,23.79 22.28,23.78 | LCD1.1 18.63,34.19 v18.1,34.72 | LCD1.13 18.16,24.58 v17.86,24.28 18.02,24.12 18.02,23.81 18.04,23.79 LCD1.14
  Bottom 0.508: LCD1.14 22.18,23.79 23.01,22.96 | v23.26,22.41 23.24,22.41 v22.63,23.02 | v17.84,25.31 17.86,25.29 v17.86,24.28
  Bottom 0.6: v50.55,39.77 37.55,39.77 36.76,38.98 35.86,38.98 34.89,38.98 31.07,35.16 31.07,32.49 28.17,29.59 28.17,26.36 | v49.63,38.47 38.11,38.47 37.39,37.75 35.47,37.75 32.33,34.62 32.33,32.09 31.37,31.13
  other vias: 25.23,30.55 26.14,30.52 25.19,29.25 26.12,29.26 29.51,26.33 9.17,45.03 7.85,46.26 8.77,45.93 37.43,55.9 46.83,56 56.53,53.4 52.13,52.9 53.53,50.6 37.33,52.3 47.03,48.8 48.83,44.9 46.33,43.4 37.03,49.5 28.33,45.9 28.73,43.7 41.53,38.4 50.53,37.1 19.93,47.9 21.63,50 21.43,54 14.63,48 11.03,46.6 11.71,42.29 11.43,43.3 6.63,43.5 6.73,42 7.03,38.4 27.83,9.3 36.73,13.3 36.73,10.9 39.93,6.5 48.33,9.3 44.43,12 41.43,15.2 27.43,32.3 27.53,33.9 28.43,33.5 27.13,26.9 28.03,27.2 25.83,26.3 26.63,25.4 33.43,25 33.43,23.4 37.93,17.5 34.43,12 43.03,18.3 42.93,20.6 49.23,23 49.33,21.5 46.03,21.5 42.93,27.7 34.33,34.1 34.43,32.7 44.63,29.4 49.23,29.4 45.63,23.2 52.93,29.3 52.63,25.2 52.83,22.1 63.93,40.7 57.33,35.6 61.03,35.6 59.53,39.1 58.53,38.3 61.63,32.5 63.83,30.1 63.83,17.7 53.33,16.4 53.83,19.9 56.53,13.4 56.33,10.6 53.78,10.56 48.83,12.2 47.43,12.4 47.73,14.8 48.33,16.3 52.82,18.26 1.08,46.6 1.08,36.14 53.49,2.03 43.56,37.35 45.86,51.63 48.03,52.74 37.9,36.41 31.07,17.66 33.76,17.88 34.18,13.18 42.98,25.16 45.38,25.62 49.23,25.7 8.82,31.65 3.94,34.84 3.93,28.42 4.04,31.79 11.97,29.52 9.85,30.39 10.81,27.01 12.92,27.02 0.81,29.16 0.99,42.03 14.22,25.57 27.93,56.59 8.15,56.8 1.26,52.43 4.58,56.98 41.7,56.95 55.75,56.87 61.08,57.03 63.92,53.24 52.4,14.34 54.22,13.43 49.11,14.13 50.52,11.62 60.76,9.61 60.73,14.19 63.04,11.95 63.83,4.95 58.63,1.28 48.24,1.16 40.15,1.2 26.22,1.74 33.73,1.63 23.45,18.79 23.51,8.37 24.78,11.47 24.69,14.3 25.26,16.91 27.23,8.31 16.59,1.01 4.99,1.25 1.54,6.32 1.6,15.07 22.59,3.81 18.79,4.61 10.79,4.61 11.79,10.71 7.29,14.81 7.89,6.41 7.99,11.21 1.29,19.91 11.64,26.09 11.77,26.99 10.9,29.78 10.74,31.22 39.91,11.56 42.63,11.52 42.47,8.59 48.34,6.01 45.25,9.56 55.22,5.44 43.05,3.35
  pour Top (rank 2, no thermals): -0.47,50.6 -0.47,58.4 65.93,58.4 65.93,-0.7 -0.47,-0.7
  pour Bottom (rank 2, no thermals): -0.77,56.4 -0.77,58.7 66.23,58.7 66.23,-1 -0.77,-1
IO0
  Top 0.203: U2.25 52.71,35.11 53.93,36.33 61.61,36.33 62.03,36.75 62.03,39.03 60.55,40.51 56.89,40.51 55.77,41.63 55.77,52.77 53.39,55.16 46.16,55.16 45.25,56.06 38.78,56.06 37.33,54.61 27.31,54.61 25.64,56.28 20.98,56.28 K18.2
  Top 0.305: C12.1 R21.1 20.85,47.17 20.85,52.99 19.56,54.27 K18.2
LCD_BLK
  Top 0.203: U2.27 54.39,37.65 R23.1
LCD_CS  (via drill 0.3 pad 0.6)
  Top 0.203: U2.24 49.01,33.62 49.01,34.72 47.84,35.9 40.09,35.9 39.6,35.41 38.56,35.41 v38.44,35.53 | v26.21,20.79 26.21,21.47 23.23,24.45 v23.23,25.6
  Bottom 0.203: v38.44,35.53 38.44,35.01 37.66,34.24 37.66,25.59 35.38,23.3 35.38,21.29 34.46,20.38 26.62,20.38 v26.21,20.79 | LCD1.12 23.02,25.39 v23.23,25.6
LCD_DC  (via drill 0.3)
  Top 0.203: v37.04,47.94 37.04,47 36.31,46.27 36.31,44.26 38.69,41.88 38.69,38.33 39.27,37.75 41.32,37.75 42.69,36.38 U2.26
  Bottom 0.203: v37.04,47.94 36.93,47.83 34.36,47.83 33.73,48.46 25.38,48.46 20.76,43.84 19.03,43.84 17.72,42.53 17.72,39.88 15.67,37.83 12.8,37.83 10.8,35.83 10.8,32.36 14.17,28.99 18.04,28.99 18.44,29.39 LCD1.7
LCD_RST  (via drill 0.3 pad 0.6)
  Top 0.203: v17.32,30.23 17.18,30.38 R31.1
  Bottom 0.203: LCD1.6 17.37,30.19 v17.32,30.23
LED-  (via drill 0.3 pad 0.6)
  Top 0.4: 53.03,54.62 52.95,54.7 45.97,54.7 45.77,54.9 v39.14,54.9
  Top 0.406: R22.2 59.71,40.05 56.67,40.05 55.16,41.55 55.16,52.49 53.03,54.62
  Bottom 0.4: v39.14,54.9 39.14,48.79 37.49,47.13 25.55,47.13 21.22,42.81 19.42,42.81 18.67,42.06 18.67,39.46 16.13,36.92 13.35,36.92 12.06,35.62 12.06,34.46 13.9,32.62 20.62,32.62 LCD1.3
LINK_LED  (via drill 0.3 pad 0.6)
  Top 0.203: U4.3 25.12,25.99 28.58,22.53 28.58,19.43 v29.84,18.17
  Bottom 0.203: v29.84,18.17 28.72,17.05 27.37,17.05 26.11,15.79 26.11,9.18 20.15,3.21 7.69,3.21 4.74,6.16 4.74,18.62 J1.9
MCU_3V3
  Top 0.5: R2.2 27.05,47.08 C20.1 27.95,45.2 27.95,42.75 26.58,41.37 26.58,41 | 26.58,41 26.58,38.49 U1.16 | R21.2 21.62,45.06 22.37,44.32 U1.4 22.37,42.16 22.73,41.8 24.48,41.8 25.3,40.97 26.55,40.97 26.58,41
  Top 0.508: L4.2 32,50.43 C19.1 | C19.1 C1.2 30.35,47.38 R2.2 | C19.1 34.48,50.3 U2.2
MISO  (via drill 0.3, 0.35)
  Top 0.203: v38.77,23.45 38.63,23.32 36.67,23.32 U5.13 | U2.7 35.13,44.01 37.85,41.28 37.85,37.54 v39.29,36.11 | v6.61,26.51 v6.6,26.52 U58.12
  Bottom 0.203: v39.29,36.11 39.29,35.2 38.07,33.98 38.07,28.66 40.37,26.36 40.37,25.03 38.8,23.45 v38.77,23.45 38.77,22.56 35.4,19.19 25.75,19.19 24.02,20.92 22.58,20.92 21.13,22.37 16.64,22.37 15.08,23.93 11.21,23.93 8.78,26.36 6.76,26.36 v6.61,26.51
MOSI  (via drill 0.3, 0.3 pad 0.6)
  Top 0.203: v37.4,22.3 37.4,20.65 36.96,20.21 U5.14 | U2.8 35.75,42.73 37.47,41.01 37.47,37.05 36.56,36.13 36.56,32.65 36.84,32.36 37.27,32.36 38.6,31.03 38.6,27.47 39.77,26.3 39.77,25.53 v39.58,25.34 | U58.14 7.83,28.93 v7.83,27.23
  Bottom 0.203: v39.58,25.34 39.5,25.34 37.4,23.24 v37.4,22.3 37.4,22.13 34.85,19.58 25.94,19.58 24.18,21.34 22.78,21.34 21.38,22.74 16.82,22.74 15.27,24.29 11.49,24.29 9.01,26.77 8.29,26.77 v7.83,27.23 9.19,28.59 LCD1.8
N$1
  Top 0.508: Q3.3 59.66,38.04 60.42,37.28 R22.1
N$2
  Top 0.305: R26.1 43.52,11.71 44.87,10.37 48.68,10.37 50.05,9 D2.A
N$3
  Top 0.305: R27.1 38.92,13.61 38.92,10.89 43.51,6.3 D3.A
N$4
  Top 0.6: D4.1 56.57,31.93 C26.2 57.96,32.06 C27.1 60.74,30.86 U6.3
  pour Top (no thermals): 54.63,29.7 54.73,29.8 56.43,29.8 56.73,30.1 56.73,31 57.03,31.3 59.23,31.3 59.63,30.9 59.63,28.2 59.73,28.1 59.73,28 60.03,27.7 61.53,27.7 61.83,28 61.83,31 60.33,32.5 54.83,32.5 54.43,32.1 54.43,29.9
N$5
  Top 0.203: U5.10 35.04,28.21 34.08,27.25 34.08,21.14 32.32,19.38 R29.2
N$6
  Top 0.813: J1.M2 14.02,7.15 13.51,7.66 13.51,18.31 14.02,18.82 J1.M1 12.19,22.89 R28.1
  Bottom 0.813: J1.8 18.86,7.88 17.37,7.88 | 17.37,7.88 15.88,7.88 14.02,6.01 J1.M2 | J1.7 17.32,7.93 17.37,7.88
N$9
  Top 0.203: R23.2 R24.1 57.32,38.8 Q3.1
N$10
  Top 0.305: J1.10 4.46,19.01 R11.2
N$11
  Top 0.813: U5.1 50.71,14.53 arc90 53.25,11.99 J21.1
N$15
  Top 0.305: J1.11 6.07,15.39 3.67,17.79 3.67,22.37 R10.2
N$16
  Top 0.305: 8.15,44.88 U3.4 7.95,43.87 8.19,43.63 8.72,43.63 9.37,42.98 U3.1
  Top 0.508: D1.1 C2.2 5.08,44.74 C13.1 6.85,44.88 U3.4
  pour Top (no thermals): 3.73,42 3.73,44.8 4.23,45.3 8.23,45.3 8.33,45.3 8.43,45.2 8.43,44.6 8.03,44.2 7.93,44.2 7.83,44.1 6.03,44.1 5.73,43.8 5.73,43.7 5.73,41.3 5.43,41 4.13,41 4.03,41 3.73,41.3
N$17
  Top 0.305: R12.2 R13.1 8.39,42.54 U3.5
N$18
  Top 0.305: U4.24 23.35,28.6 22.12,28.6 R3.2
N$19
  pour Top (no thermals): 9.93,45.5 10.33,45.9 12.03,45.9 12.23,45.7 12.23,44.2 11.93,43.9 11.53,43.9 11.23,44.2 11.23,44.3 10.93,44.6 9.93,44.6
N$20
  Top 0.203: R16.1 33.73,12.46 33.73,11.7 34.68,10.75 J3.B5
N$21
  Top 0.203: R1.2 28.35,12.28 28.97,11.66 30.31,11.66 31.68,10.29 31.68,10.28 J3.A5
N$22
  Top 0.203: R17.2 24.96,44.86 24.96,43.1 U1.2
N$23
  Top 0.203: R18.2 23.66,43.07 U1.3
PEN  (via drill 0.3 pad 0.6)
  Top 0.203: U2.5 35.59,46.54 36.22,47.17 v36.22,48.76 | v5.93,30.56 5.97,30.52 U58.11 | v10.96,37.83 10.13,37.83 R19.2
  Bottom 0.203: v36.22,48.76 36.22,48.66 35.74,48.18 34.93,48.18 34.3,48.81 25.06,48.81 20.53,44.29 18.88,44.29 17.3,42.72 17.3,40.12 15.47,38.29 12.61,38.29 11.61,37.28 | 11.61,37.28 10.26,35.94 10.26,31.99 8.83,30.56 v5.93,30.56 | 11.61,37.28 11.06,37.83 v10.96,37.83
RA_3V3
  Top 0.6: U6.2 58.15,25.93 | 58.15,25.93 U6.4 | 58.15,25.93 58.35,25.72 C28.2 58.23,21.51 C29.1 C25.2 55.23,21.47 53.62,21.47 52.38,20.23 | 52.38,20.23 | 52.38,20.23 52.36,20.21 U5.3
  pour Top (no thermals): 53.33,26.9 53.33,28.4 53.93,29 54.13,29.2 58.13,29.2 58.33,29.2 59.23,28.3 59.23,26.9 59.53,26.6 61.83,26.6 62.03,26.4 62.03,25.5 62.03,25.4 61.83,25.2 59.53,25.2 59.23,24.9 59.23,24.8 59.23,21.3 59.13,21.2 59.03,21.1 57.73,21.1 57.53,21.3 57.53,21.8 57.53,22.4 57.23,22.7 54.23,22.7 53.43,23.5 53.33,23.6
RA_BUSY  (via drill 0.3)
  Top 0.203: U2.6 35.26,45.27 35.68,44.85 35.68,44.03 38.29,41.42 38.29,38.16 39.71,36.74 40.3,36.74 v40.43,36.61 | R29.1 31.26,18.49 32.99,18.49 33.66,19.16 36.57,19.16 38.16,20.75 v38.18,20.75
  Bottom 0.203: v38.18,20.75 38.16,20.78 40.9,23.52 40.9,26.52 38.56,28.86 38.56,33.8 39.83,35.07 39.83,35.7 40.43,36.31 v40.43,36.61
RA_DIO1  (via drill 0.3 pad 0.6)
  Top 0.203: U2.16 39.07,33.38 39.07,29.97 v39.62,29.42 | v42.93,26.39 50.78,26.39 U5.6
  Bottom 0.203: v39.62,29.42 42.65,26.39 v42.93,26.39
RA_NSS
  Top 0.203: U2.13 35.22,36.38 35.67,35.93 35.67,32.22 36.39,31.51 36.97,31.51 37.67,30.81 37.67,26.14 40.1,23.71 40.1,19.14 39.17,18.21 U5.15
RA_RST  (via drill 0.3 pad 0.6)
  Top 0.203: v42.85,19.41 45.65,22.21 50.46,22.21 | U2.14 34.62,35.11 35.16,34.57 35.16,32.07 36.1,31.14 36.75,31.14 37.31,30.58 37.31,25.77 39.43,23.65 39.43,19.59 v39.34,19.5
  Top 0.305: 50.46,22.21 U5.4
  Bottom 0.203: v42.85,19.41 39.43,19.41 v39.34,19.5
RMII_CLK  (via drill 0.35)
  Top 0.203: U4.5 26.13,26.9 27.46,25.57 v28.67,25.57 | v50.51,38.88 50.56,38.92 U2.28
  Bottom 0.203: v28.67,25.57 28.87,25.77 28.87,29.41 31.7,32.25 31.7,34.93 35.17,38.39 37.13,38.39 37.86,39.12 50.2,39.12 50.45,38.88 v50.51,38.88
RMII_CRS_DV  (via drill 0.3 pad 0.6)
  Top 0.203: U4.11 28.15,30.62 29.03,31.5 v29.03,31.6 | v36.2,39.78 36.2,38.39 35.46,37.65 U2.12
  Bottom 0.203: v29.03,31.6 30.5,33.07 30.5,35.53 34.91,39.94 36.04,39.94 v36.2,39.78
RMII_RXD0
  Top 0.203: U4.8 27.39,29.1 29.23,29.1 29.77,29.64 32.37,29.64 32.93,30.2 32.93,39.49 33.62,40.19 U2.10
RMII_RXD1
  Top 0.203: U4.7 29.26,28.62 29.89,29.26 32.55,29.26 33.29,30 33.29,38.1 34.11,38.92 U2.11
RMII_TX_EN  (via drill 0.3 pad 0.6, 0.35 pad 0.6)
  Top 0.203: U4.16 25.12,34.38 27.84,37.1 27.84,39.29 v29.19,40.64 | v50.43,45.3 52,45.3 U2.33
  Bottom 0.203: v29.19,40.64 29.22,40.64 29.9,41.32 48.55,41.32 50.43,43.2 v50.43,45.3
RMII_TXD0  (via drill 0.3 pad 0.6, 0.35 pad 0.6)
  Top 0.203: U4.17 24.62,34.4 27.49,37.27 27.49,40.12 v29.16,41.8 | v48.93,42.7 48.96,42.73 U2.31
  Bottom 0.203: v29.16,41.8 29.29,41.68 47.81,41.68 48.83,42.7 v48.93,42.7
RMII_TXD1  (via drill 0.3 pad 0.6, 0.35 pad 0.6)
  Top 0.203: U4.18 24.13,34.5 27.13,37.5 27.13,40.8 v29.13,42.8
  Top 0.305: v49.93,49.1 52.01,49.1 U2.36
  Bottom 0.203: v29.13,42.8 29.89,42.04 47.21,42.04 49.63,44.46 49.63,48.8 v49.93,49.1
RX_N  (via drill 0.3 pad 0.6)
  Top 0.203: U4.22 19.18,29.62 16.73,27.17 16.73,20.69 17.72,19.7 19.33,19.7 21.38,17.65 21.38,7.23 20.31,6.16 17.48,6.16 15.09,8.55 15.09,12.38 16.58,13.88 17.92,13.88 19.86,11.95 J1.6 | v12.17,12.04 11.92,12.29 11.35,12.29 7.41,16.23 7.41,20.58 6.28,21.7 6.28,22.3 R9.1
  Bottom 0.203: v12.17,12.04 12.47,12.34 14.9,12.34 15.83,11.41 J1.6
RX_P  (via drill 0.3 pad 0.6)
  Top 0.203: U4.23 19.33,29.12 17.13,26.92 17.13,20.9 17.96,20.08 19.51,20.08 21.78,17.81 21.78,7.04 20.54,5.8 17.33,5.8 14.73,8.4 14.73,12.64 J1.3 | v12.16,13 11.87,12.71 11.43,12.71 7.76,16.38 7.76,20.72 6.64,21.85 6.64,22.44 R8.1
  Bottom 0.203: v12.16,13 12.44,12.72 15.04,12.72 17.32,14.99 J1.3
SCK  (via drill 0.3, 0.3 pad 0.6)
  Top 0.203: v38.82,26.18 38.82,26.21 38.17,26.85 38.17,30.89 37.14,31.92 36.63,31.92 36.1,32.44 36.1,36.58 37.07,37.55 37.07,40.67 36.28,41.46 U2.9 | v37.35,24.42 37.14,24.21 U5.12 | U58.16 9.72,28.39 v9.72,27.52
  Bottom 0.203: v38.82,26.18 38.82,25.55 37.68,24.42 v37.35,24.42 35.73,22.8 35.73,21.05 34.65,19.97 26.17,19.97 24.42,21.73 23.02,21.73 21.55,23.19 17,23.19 15.54,24.65 11.89,24.65 9.72,26.82 v9.72,27.52 9.99,27.79 LCD1.9
SPEED_LED  (via drill 0.3 pad 0.6)
  Top 0.203: U4.2 24.62,25.81 27.94,22.49 v27.94,21.58 28.15,21.37 28.15,18.87 v28.87,18.15 | v29.19,20.99 30.2,20.99 R4.2
  Bottom 0.203: v28.87,18.15 28.3,17.58 27.36,17.58 25.74,15.96 25.74,9.31 20.04,3.61 8.41,3.61 6.07,5.96 J1.12 | v29.19,20.99 28.59,21.59 v27.95,21.59 v27.94,21.58
TX_N  (via drill 0.3 pad 0.6)
  Top 0.203: U4.20 18.64,30.62 15.63,27.61 15.63,18.9 14.43,17.7 14.43,16.59 15.06,15.96 16.12,15.96 16.66,16.49 J1.2 | v12.14,13.98 11.89,14.23 10.97,14.23 8.38,16.82 8.38,20.23 9.02,20.87 9.02,22.38 R7.1
  Bottom 0.203: v12.14,13.98 12.42,13.98 12.56,14.12 15.4,14.12 15.89,14.61 15.89,15.73 16.65,16.49 J1.2
TX_P  (via drill 0.3 pad 0.6)
  Top 0.203: U4.21 18.84,30.12 15.99,27.28 15.99,18.76 14.79,17.55 14.79,16.88 15.27,16.39 15.95,16.39 17.32,17.76 J1.1 | v12.2,14.86 11.94,14.6 11.1,14.6 8.73,16.97 8.73,20.07 9.38,20.71 9.38,22.35 R6.1
  Bottom 0.203: v12.2,14.86 12.45,14.61 15.13,14.61 15.47,14.95 15.47,15.91 J1.1
USB_DN  (via drill 0.3 pad 0.6)
  Top 0.203: U1.6 19.83,42.58 20.26,42.14 20.26,41.62 21,40.88 23.36,40.88 23.55,40.69 v23.55,40.37 | R14.2 30.36,15.47 30.36,16.4 29.96,16.8 28.49,16.8 26.82,18.47 26.82,21.67 23.9,24.58 v23.9,24.75
  Bottom 0.203: v23.9,24.75 23.93,24.75 23.97,24.79 23.97,39.82 23.58,40.21 23.58,40.37 v23.55,40.37
USB_DP  (via drill 0.3 pad 0.6)
  Top 0.203: R15.2 30.76,15.46 30.76,16.51 30.01,17.26 28.68,17.26 27.2,18.75 27.2,21.83 24.7,24.33 24.7,24.6 v24.81,24.71 | U1.5 21.1,42.58 20.65,42.14 20.65,41.8 21.19,41.26 23.77,41.26 24.46,40.57 v24.46,40.38
  Bottom 0.203: v24.81,24.71 24.81,24.76 24.39,25.18 24.39,40.31 v24.46,40.38
VDDRC
  Top 0.305: U4.6 29.08,27.87 29.89,27.06 C5.2 30.37,28.45 C6.2
XL  (via drill 0.3 pad 0.6)
  Top 0.203: U58.4 7.24,33.87 8.21,32.89 10.6,32.89 11.48,33.77 11.48,34.97 12.23,35.72 13.34,35.72 v13.42,35.64
  Bottom 0.203: v13.42,35.64 13.91,35.15 16.66,35.15 18.13,36.62 LCD1.T2
XP_CS  (via drill 0.35)
  Top 0.203: U2.23 47.73,34.84 47.37,35.19 v40.5,35.19 | U58.15 v8.51,25.73 v8.5,25.73
  Bottom 0.203: v40.5,35.19 40.5,34.9 38.93,33.33 38.93,29.25 41.45,26.73 41.45,22.53 37.75,18.82 25.59,18.82 23.87,20.54 22.44,20.54 21.01,21.97 16.46,21.97 14.95,23.48 10.74,23.48 v8.5,25.72 v8.5,25.73
XR  (via drill 0.3 pad 0.6)
  Top 0.203: U58.2 8.51,34.02 8.72,33.8 10.19,33.8 10.64,34.24 10.64,35.31 11.98,36.66 14.85,36.66 15.31,36.2 v15.42,36.2
  Bottom 0.203: v15.42,36.2 16.45,36.2 18.47,38.22 LCD1.T4
YD  (via drill 0.3 pad 0.6)
  Top 0.203: U58.3 7.87,34.01 8.56,33.32 10.35,33.32 10.99,33.97 10.99,35.04 12.2,36.25 14.15,36.25 v14.35,36.05
  Bottom 0.203: v14.35,36.05 14.82,35.58 16.48,35.58 18.31,37.42 LCD1.T3
YU  (via drill 0.3 pad 0.6)
  Top 0.203: U58.5 6.6,33.87 7.98,32.49 10.84,32.49 11.92,33.57 11.92,34.74 12.24,35.06 v12.78,35.06
  Bottom 0.203: v12.78,35.06 13.08,34.76 17.01,34.76 18.07,35.82 LCD1.T1

### Text on the board
bPlace: www.elecrow.com | Lora Basic Gateway Module V1.0 | LCD